# Altium schematic sheet Power_supply_LED.SchDoc
size A
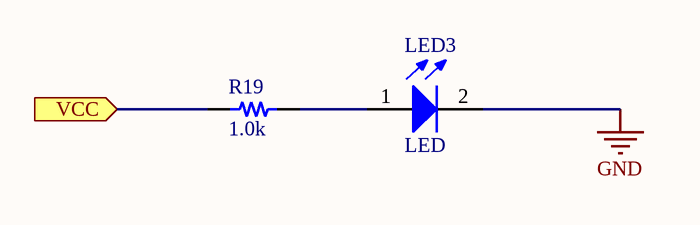
[diagram p0: Power_supply_LED.SchDoc]

## Parts
LED3  LED  [0805_LED]
R19  value 1.0k  [RES 0805/2012]  (hidden comment: Resistor 1.0k 0805 1/10W 10%)

## Ports
VCC (in)

## Nets
GND: LED3.2(K)
VCC: R19.1 ; port VCC
NetLED3_1: LED3.1(A) R19.2

## Library data of the parts
LED3 = 2: Manufacturer_id: 1; idLED: 2; Name: LED_0805_GREEN; Value: Green; Brightness: 35mcd; Id: 20mA; Vf: 2V; Drawer_id: 1
R19 = 2413: Manufacturer_id: 1; idResistor: 2413; Name: Res_1.0k_0805_1/10W_10%; Created_By: Nick Mah; Supplier 1: Digi-Key; Drawer_id: 1; Tolerance: 10%; Power: 1/10W; Package: 0805; ComponentLink1Description: Datasheet; Created_Date: 2018-10-20